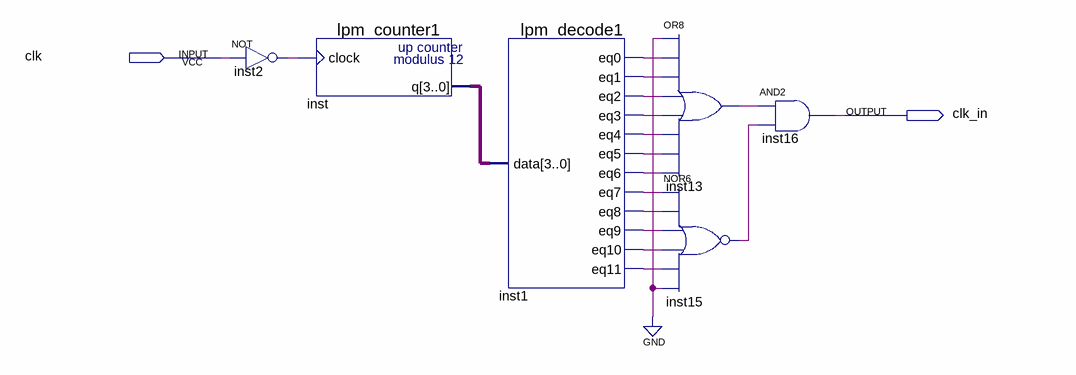
[diagram p0: schematic sheet]
// Quartus schematic Block1.bdf as structural Verilog: 6 symbols, 2 pins
module Block1 (
  input  clk,
  output clk_in
);

  wire inst1_eq0, inst1_eq1, inst1_eq2, inst1_eq3, inst1_eq4, inst1_eq5, inst1_eq6, inst1_eq7, inst1_eq8,
       inst1_eq9, inst1_eq10, inst1_eq11, inst2_out, inst13_out, inst15_out;
  wire [3:0] inst_q;

  not inst2 (inst2_out, clk);
  lpm_counter1 inst (.clock(inst2_out), .q(inst_q));
  lpm_decode1 inst1 (
    .data(inst_q), .eq0(inst1_eq0), .eq1(inst1_eq1), .eq2(inst1_eq2), .eq3(inst1_eq3), .eq4(inst1_eq4),
    .eq5(inst1_eq5), .eq6(inst1_eq6), .eq7(inst1_eq7), .eq8(inst1_eq8), .eq9(inst1_eq9), .eq10(inst1_eq10),
    .eq11(inst1_eq11));
  or inst13 (inst13_out, 1'b0, inst1_eq0, inst1_eq1, inst1_eq2, inst1_eq3, inst1_eq4, inst1_eq5, inst1_eq6);
  nor inst15 (inst15_out, inst1_eq7, inst1_eq8, inst1_eq9, inst1_eq10, inst1_eq11, 1'b0);
  and inst16 (clk_in, inst13_out, inst15_out);
endmodule
